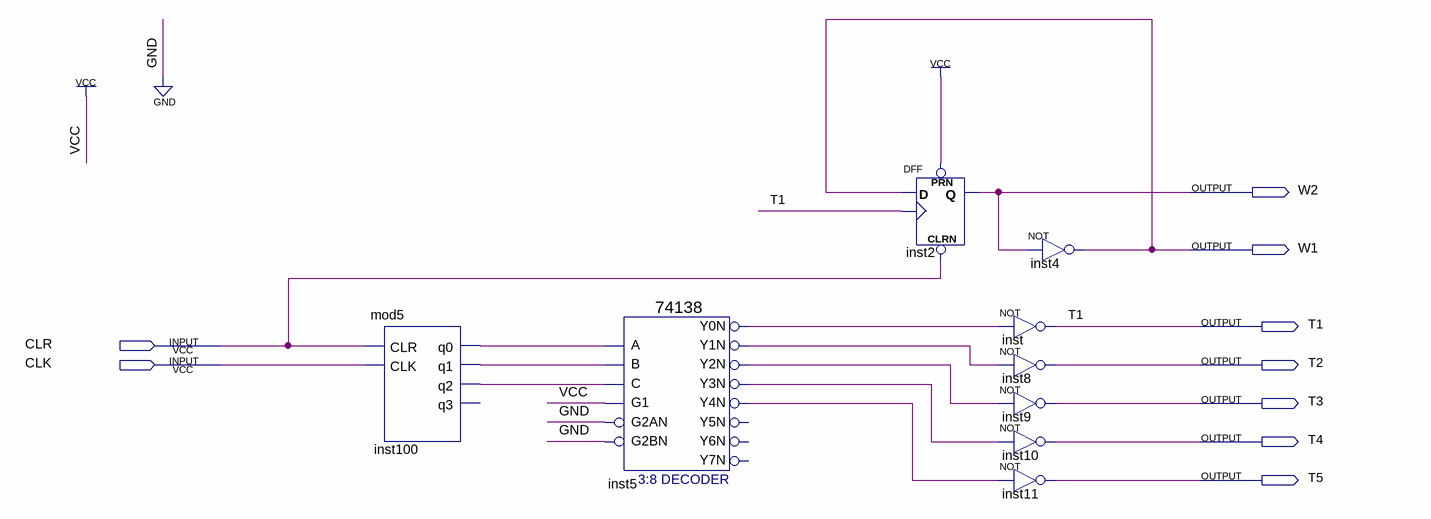
[diagram p0: schematic sheet]
// Quartus schematic timing.bdf as structural Verilog: 9 symbols, 9 pins
module timing (
  input  CLR,
  input  CLK,
  output W2,
  output W1,
  output T1,
  output T2,
  output T3,
  output T4,
  output T5
);

  wire inst5_y0n, inst5_y1n, inst5_y2n, inst5_y3n, inst5_y4n, inst100_q0, inst100_q1, inst100_q2;

  mod5 inst100 (.CLR(CLR), .CLK(CLK), .q0(inst100_q0), .q1(inst100_q1), .q2(inst100_q2));  // open: q3
  \74138  inst5 (
    .A(inst100_q0), .B(inst100_q1), .G1(1'b1), .C(inst100_q2), .G2AN(1'b0), .G2BN(1'b0), .Y0N(inst5_y0n),
    .Y1N(inst5_y1n), .Y2N(inst5_y2n), .Y3N(inst5_y3n), .Y4N(inst5_y4n));  // open: Y5N, Y6N, Y7N
  DFF inst2 (.CLRN(CLR), .CLK(T1), .D(W1), .PRN(1'b1), .Q(W2));
  not inst4 (W1, W2);
  not inst (T1, inst5_y0n);
  not inst8 (T2, inst5_y1n);
  not inst9 (T3, inst5_y2n);
  not inst10 (T4, inst5_y3n);
  not inst11 (T5, inst5_y4n);
endmodule
